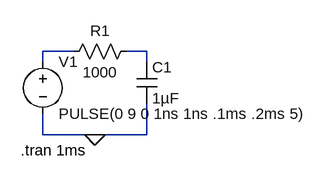
[diagram p0: schematic Draft4.asc]
Draft4.asc, the LTspice schematic file:
Version 4
SHEET 1 880 680
WIRE 160 80 112 80
WIRE 272 80 240 80
WIRE 112 96 112 80
WIRE 272 96 272 80
WIRE 112 208 112 176
WIRE 192 208 112 208
WIRE 272 208 272 160
WIRE 272 208 192 208
FLAG 192 208 0
SYMBOL res 256 64 R90
WINDOW 0 0 56 VBottom 2
WINDOW 3 32 56 VTop 2
SYMATTR InstName R1
SYMATTR Value 1000
SYMBOL cap 256 96 R0
SYMATTR InstName C1
SYMATTR Value 1µF
SYMBOL voltage 112 80 R0
WINDOW 123 0 0 Left 2
WINDOW 39 0 0 Left 2
SYMATTR InstName V1
SYMATTR Value PULSE(0 9 0 1ns 1ns .1ms .2ms 5)
TEXT 78 232 Left 2 !.tran 1ms

The netlist it stands for:
* Draft4.asc
R1 N002 N001 1000
C1 N002 0 1µF
V1 N001 0 PULSE(0 9 0 1ns 1ns .1ms .2ms 5)
.tran 1ms
.backanno
.end